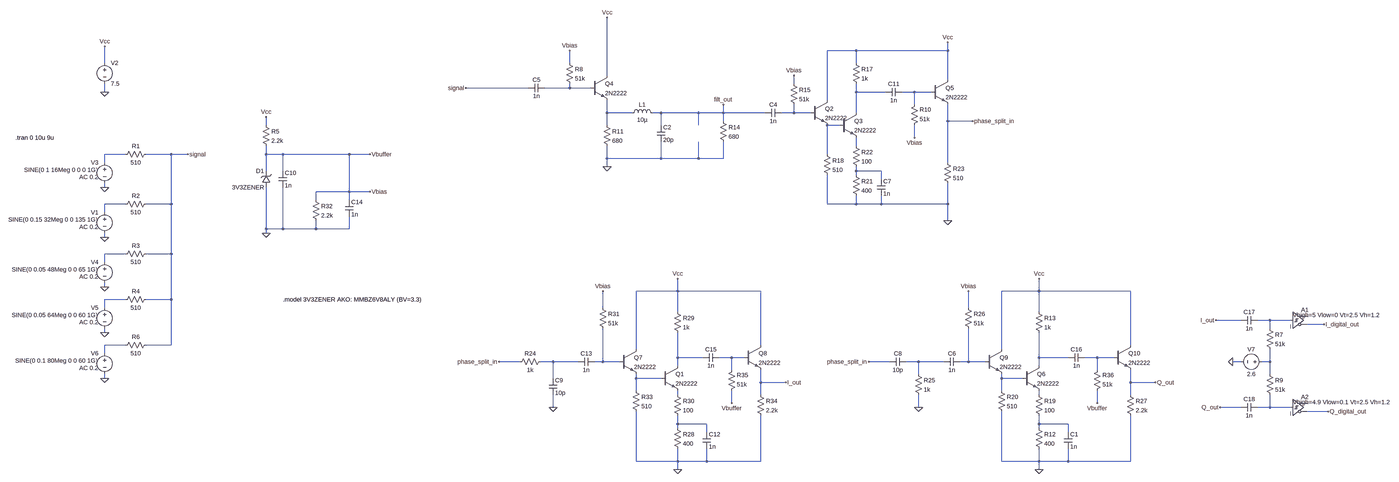
[diagram p0: schematic 16MHz_quadrature_phase_splitter.asc, whole sheet]
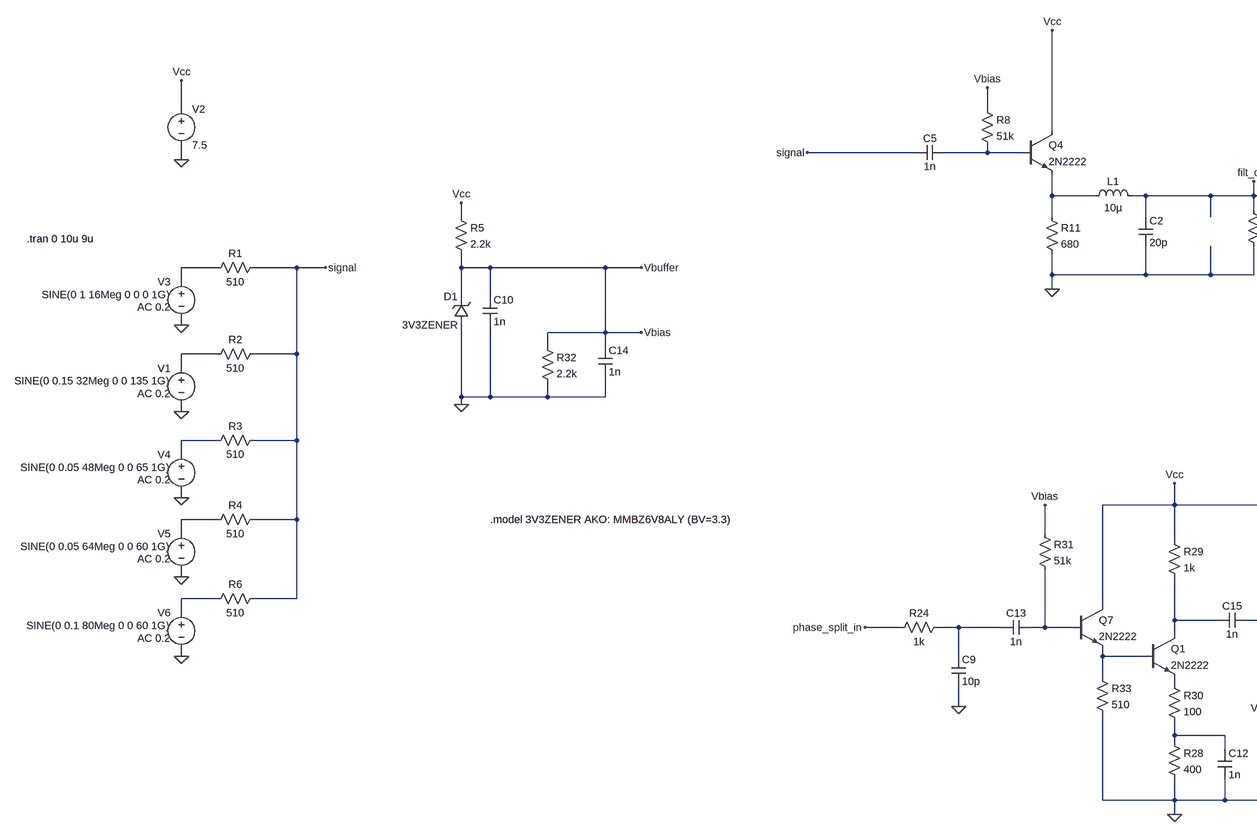
[diagram p1: schematic 16MHz_quadrature_phase_splitter.asc, part, row 1 of 1, column 1 of 2]
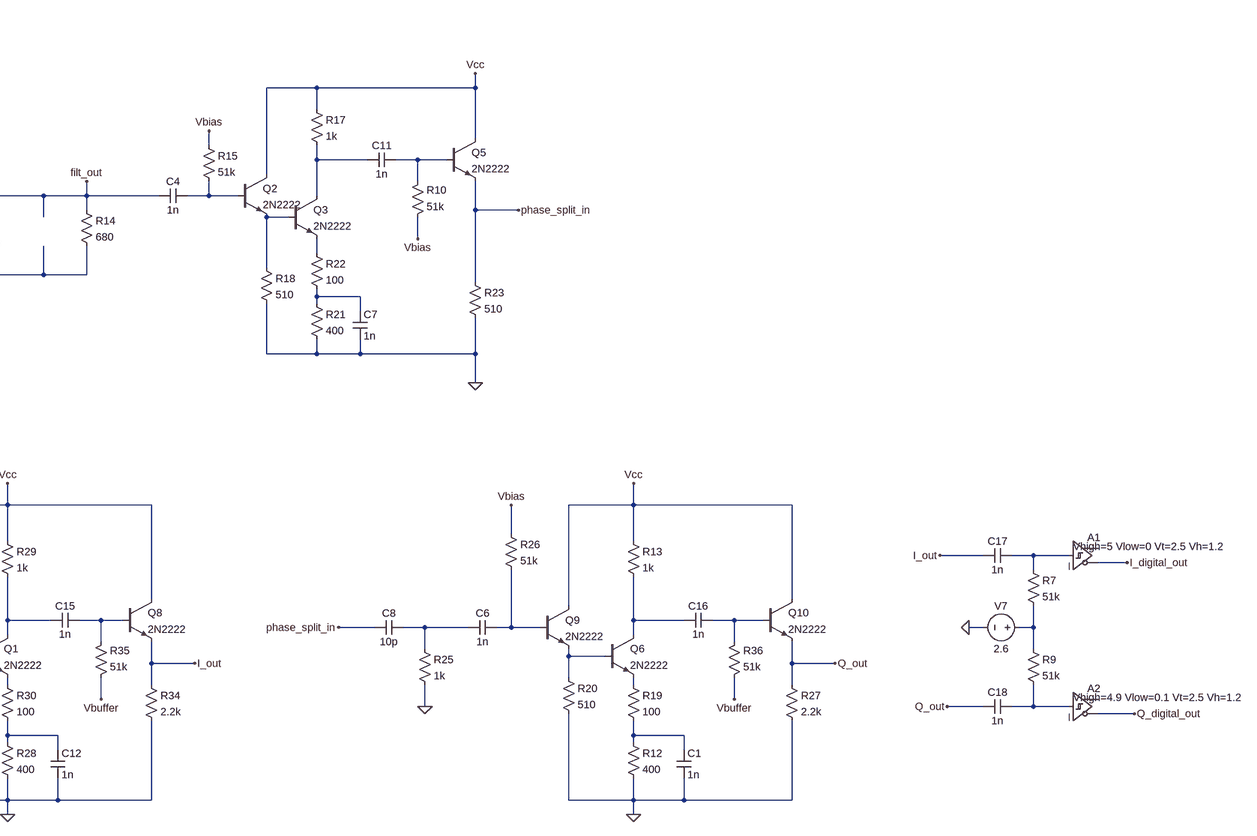
[diagram p2: schematic 16MHz_quadrature_phase_splitter.asc, part, row 1 of 1, column 2 of 2]
16MHz_quadrature_phase_splitter.asc, the LTspice schematic file:
Version 4
SHEET 1 4924 2628
WIRE 2736 32 2624 32
WIRE 3088 32 3088 0
WIRE 3088 32 2736 32
WIRE -464 80 -464 16
WIRE 1632 80 1632 32
WIRE 2736 80 2736 32
WIRE 1776 128 1776 -96
WIRE 3088 144 3088 32
WIRE 2496 160 2496 128
WIRE 1472 176 1232 176
WIRE 1632 176 1632 160
WIRE 1632 176 1536 176
WIRE 1712 176 1632 176
WIRE -464 192 -464 160
WIRE 2736 192 2736 160
WIRE 2848 192 2736 192
WIRE 2960 192 2912 192
WIRE 3024 192 2960 192
WIRE 2624 224 2624 32
WIRE 2960 240 2960 192
WIRE 1776 272 1776 224
WIRE 1872 272 1776 272
WIRE 1984 272 1952 272
WIRE 2128 272 1984 272
WIRE 2224 272 2224 240
WIRE 2224 272 2128 272
WIRE 2384 272 2224 272
WIRE 2496 272 2496 240
WIRE 2496 272 2448 272
WIRE 2560 272 2496 272
WIRE 2736 272 2736 192
WIRE 2224 304 2224 272
WIRE 3088 304 3088 240
WIRE 3184 304 3088 304
WIRE 288 320 288 288
WIRE 1776 320 1776 272
WIRE 1984 320 1984 272
WIRE 2128 320 2128 272
WIRE 2672 320 2624 320
WIRE 2960 368 2960 320
WIRE 2736 400 2736 368
WIRE -384 432 -464 432
WIRE -208 432 -304 432
WIRE -144 432 -208 432
WIRE 288 432 288 400
WIRE 352 432 288 432
WIRE 608 432 352 432
WIRE 688 432 608 432
WIRE 2624 432 2624 320
WIRE 1776 448 1776 400
WIRE 1984 448 1984 384
WIRE 1984 448 1776 448
WIRE 2128 448 2128 384
WIRE 2128 448 1984 448
WIRE 2224 448 2224 384
WIRE 2224 448 2128 448
WIRE -464 464 -464 432
WIRE 3088 464 3088 304
WIRE 1776 480 1776 448
WIRE 288 496 288 432
WIRE 352 496 352 432
WIRE 2736 496 2736 480
WIRE 2832 496 2736 496
WIRE 2736 512 2736 496
WIRE 2832 528 2832 496
WIRE -464 560 -464 544
WIRE 608 576 608 432
WIRE 608 576 480 576
WIRE 688 576 608 576
WIRE 480 608 480 576
WIRE 608 608 608 576
WIRE -384 624 -464 624
WIRE -208 624 -208 432
WIRE -208 624 -304 624
WIRE 2624 624 2624 512
WIRE 2736 624 2736 592
WIRE 2736 624 2624 624
WIRE 2832 624 2832 592
WIRE 2832 624 2736 624
WIRE 3088 624 3088 544
WIRE 3088 624 2832 624
WIRE -464 656 -464 624
WIRE 3088 688 3088 624
WIRE 288 720 288 560
WIRE 352 720 352 560
WIRE 352 720 288 720
WIRE 480 720 480 688
WIRE 480 720 352 720
WIRE 608 720 608 672
WIRE 608 720 480 720
WIRE 288 736 288 720
WIRE -464 752 -464 736
WIRE -384 816 -464 816
WIRE -208 816 -208 624
WIRE -208 816 -304 816
WIRE -464 848 -464 816
WIRE -464 944 -464 928
WIRE 2048 960 2048 912
WIRE 2048 960 1888 960
WIRE 2368 960 2048 960
WIRE 3440 960 3440 912
WIRE 3440 960 3296 960
WIRE 3792 960 3440 960
WIRE -384 992 -464 992
WIRE -208 992 -208 816
WIRE -208 992 -304 992
WIRE -464 1024 -464 992
WIRE 1760 1024 1760 960
WIRE 3168 1024 3168 960
WIRE 2048 1040 2048 960
WIRE 3440 1040 3440 960
WIRE 4304 1072 4208 1072
WIRE 4416 1072 4368 1072
WIRE 4496 1072 4416 1072
WIRE 4624 1088 4560 1088
WIRE 4416 1104 4416 1072
WIRE -464 1120 -464 1104
WIRE -384 1168 -464 1168
WIRE -208 1168 -208 992
WIRE -208 1168 -304 1168
WIRE 2368 1168 2368 960
WIRE 3792 1168 3792 960
WIRE 1888 1184 1888 960
WIRE 3296 1184 3296 960
WIRE -464 1200 -464 1168
WIRE 2048 1216 2048 1120
WIRE 2144 1216 2048 1216
WIRE 2256 1216 2208 1216
WIRE 2304 1216 2256 1216
WIRE 3440 1216 3440 1120
WIRE 3552 1216 3440 1216
WIRE 3664 1216 3616 1216
WIRE 3728 1216 3664 1216
WIRE 1440 1232 1360 1232
WIRE 1568 1232 1520 1232
WIRE 1664 1232 1568 1232
WIRE 1760 1232 1760 1104
WIRE 1760 1232 1728 1232
WIRE 1824 1232 1760 1232
WIRE 2864 1232 2784 1232
WIRE 2976 1232 2928 1232
WIRE 3072 1232 2976 1232
WIRE 3168 1232 3168 1104
WIRE 3168 1232 3136 1232
WIRE 3232 1232 3168 1232
WIRE 4304 1232 4272 1232
WIRE 4416 1232 4416 1184
WIRE 4416 1232 4384 1232
WIRE 2048 1248 2048 1216
WIRE 3440 1248 3440 1216
WIRE 2256 1264 2256 1216
WIRE 3664 1264 3664 1216
WIRE 2976 1280 2976 1232
WIRE 4416 1280 4416 1232
WIRE -464 1296 -464 1280
WIRE 1568 1296 1568 1232
WIRE 1888 1296 1888 1280
WIRE 1984 1296 1888 1296
WIRE 3296 1296 3296 1280
WIRE 3376 1296 3296 1296
WIRE 2368 1312 2368 1264
WIRE 2464 1312 2368 1312
WIRE 3792 1312 3792 1264
WIRE 3888 1312 3792 1312
WIRE 1888 1344 1888 1296
WIRE 3296 1344 3296 1296
WIRE 2048 1360 2048 1344
WIRE 2368 1360 2368 1312
WIRE 3440 1360 3440 1344
WIRE 3792 1360 3792 1312
WIRE 2256 1392 2256 1344
WIRE 3664 1392 3664 1344
WIRE 1568 1408 1568 1360
WIRE 2976 1408 2976 1360
WIRE 4304 1408 4224 1408
WIRE 4416 1408 4416 1360
WIRE 4416 1408 4368 1408
WIRE 4496 1408 4416 1408
WIRE 4640 1424 4560 1424
WIRE 2048 1472 2048 1440
WIRE 2160 1472 2048 1472
WIRE 3440 1472 3440 1440
WIRE 3552 1472 3440 1472
WIRE 2048 1488 2048 1472
WIRE 3440 1488 3440 1472
WIRE 2160 1504 2160 1472
WIRE 3552 1504 3552 1472
WIRE 1888 1616 1888 1424
WIRE 2048 1616 2048 1568
WIRE 2048 1616 1888 1616
WIRE 2160 1616 2160 1568
WIRE 2160 1616 2048 1616
WIRE 2368 1616 2368 1440
WIRE 2368 1616 2160 1616
WIRE 3296 1616 3296 1424
WIRE 3440 1616 3440 1568
WIRE 3440 1616 3296 1616
WIRE 3552 1616 3552 1568
WIRE 3552 1616 3440 1616
WIRE 3792 1616 3792 1440
WIRE 3792 1616 3552 1616
WIRE 2048 1648 2048 1616
WIRE 3440 1648 3440 1616
FLAG -464 192 0
FLAG -464 16 Vcc
FLAG -464 560 0
FLAG 1776 -96 Vcc
FLAG -144 432 signal
FLAG 1232 176 signal
FLAG -464 752 0
FLAG -464 944 0
FLAG -464 1120 0
FLAG 3088 0 Vcc
FLAG 2224 240 filt_out
FLAG -464 1296 0
FLAG 2048 1648 0
FLAG 2048 912 Vcc
FLAG 2464 1312 I_out
FLAG 3184 304 phase_split_in
FLAG 3440 1648 0
FLAG 3440 912 Vcc
FLAG 3888 1312 Q_out
FLAG 3088 688 0
FLAG 1632 32 Vbias
FLAG 2496 128 Vbias
FLAG 1760 960 Vbias
FLAG 3168 960 Vbias
FLAG 1360 1232 phase_split_in
FLAG 1568 1408 0
FLAG 2976 1408 0
FLAG 2784 1232 phase_split_in
FLAG 288 288 Vcc
FLAG 288 736 0
FLAG 688 576 Vbias
FLAG 3664 1392 Vbuffer
FLAG 2960 368 Vbias
FLAG 2256 1392 Vbuffer
FLAG 688 432 Vbuffer
FLAG 1776 480 0
FLAG 4208 1072 I_out
FLAG 4624 1088 I_digital_out
FLAG 4224 1408 Q_out
FLAG 4640 1424 Q_digital_out
FLAG 4272 1232 0
SYMBOL voltage -464 64 R0
WINDOW 123 0 0 Left 0
WINDOW 39 0 0 Left 0
SYMATTR InstName V2
SYMATTR Value 7.5
SYMBOL voltage -464 448 M0
WINDOW 3 24 44 Left 2
WINDOW 123 24 72 Left 2
WINDOW 39 0 0 Left 0
SYMATTR Value SINE(0 1 16Meg 0 0 0 1G)
SYMATTR Value2 AC 0.2
SYMATTR InstName V3
SYMBOL npn 1712 128 R0
SYMATTR InstName Q4
SYMATTR Value 2N2222
SYMBOL cap 1536 160 R90
WINDOW 0 0 32 VBottom 2
WINDOW 3 32 32 VTop 2
SYMATTR InstName C5
SYMATTR Value 1n
SYMBOL res 1616 64 R0
SYMATTR InstName R8
SYMATTR Value 51k
SYMBOL res 1760 304 R0
SYMATTR InstName R11
SYMATTR Value 680
SYMBOL res -288 416 R90
WINDOW 0 0 56 VBottom 2
WINDOW 3 32 56 VTop 2
SYMATTR InstName R1
SYMATTR Value 510
SYMBOL voltage -464 640 M0
WINDOW 3 24 44 Left 2
WINDOW 123 24 72 Left 2
WINDOW 39 0 0 Left 0
SYMATTR Value SINE(0 0.15 32Meg 0 0 135 1G)
SYMATTR Value2 AC 0.2
SYMATTR InstName V1
SYMBOL res -288 608 R90
WINDOW 0 0 56 VBottom 2
WINDOW 3 32 56 VTop 2
SYMATTR InstName R2
SYMATTR Value 510
SYMBOL voltage -464 832 M0
WINDOW 3 24 44 Left 2
WINDOW 123 24 72 Left 2
WINDOW 39 0 0 Left 0
SYMATTR Value SINE(0 0.05 48Meg 0 0 65 1G)
SYMATTR Value2 AC 0.2
SYMATTR InstName V4
SYMBOL res -288 800 R90
WINDOW 0 0 56 VBottom 2
WINDOW 3 32 56 VTop 2
SYMATTR InstName R3
SYMATTR Value 510
SYMBOL voltage -464 1008 M0
WINDOW 3 24 44 Left 2
WINDOW 123 24 72 Left 2
WINDOW 39 0 0 Left 0
SYMATTR Value SINE(0 0.05 64Meg 0 0 60 1G)
SYMATTR Value2 AC 0.2
SYMATTR InstName V5
SYMBOL res -288 976 R90
WINDOW 0 0 56 VBottom 2
WINDOW 3 32 56 VTop 2
SYMATTR InstName R4
SYMATTR Value 510
SYMBOL ind 1856 288 R270
WINDOW 0 32 56 VTop 2
WINDOW 3 5 56 VBottom 2
SYMATTR InstName L1
SYMATTR Value 10µ
SYMBOL cap 1968 320 R0
SYMATTR InstName C2
SYMATTR Value 20p
SYMBOL res 2208 288 R0
SYMATTR InstName R14
SYMATTR Value 680
SYMBOL cap 2448 256 R90
WINDOW 0 0 32 VBottom 2
WINDOW 3 32 32 VTop 2
SYMATTR InstName C4
SYMATTR Value 1n
SYMBOL npn 2560 224 R0
SYMATTR InstName Q2
SYMATTR Value 2N2222
SYMBOL res 2480 144 R0
SYMATTR InstName R15
SYMATTR Value 51k
SYMBOL res 2608 416 R0
SYMATTR InstName R18
SYMATTR Value 510
SYMBOL npn 2672 272 R0
SYMATTR InstName Q3
SYMATTR Value 2N2222
SYMBOL res 2720 384 R0
SYMATTR InstName R22
SYMATTR Value 100
SYMBOL res 2720 64 R0
SYMATTR InstName R17
SYMATTR Value 1k
SYMBOL res 2720 496 R0
SYMATTR InstName R21
SYMATTR Value 400
SYMBOL cap 2816 528 R0
SYMATTR InstName C7
SYMATTR Value 1n
SYMBOL npn 3024 144 R0
SYMATTR InstName Q5
SYMATTR Value 2N2222
SYMBOL res 3072 448 R0
SYMATTR InstName R23
SYMATTR Value 510
SYMBOL res 1536 1216 R90
WINDOW 0 0 56 VBottom 2
WINDOW 3 32 56 VTop 2
SYMATTR InstName R24
SYMATTR Value 1k
SYMBOL cap 2928 1216 R90
WINDOW 0 0 32 VBottom 2
WINDOW 3 32 32 VTop 2
SYMATTR InstName C8
SYMATTR Value 10p
SYMBOL cap 1552 1296 R0
SYMATTR InstName C9
SYMATTR Value 10p
SYMBOL res 2960 1264 R0
SYMATTR InstName R25
SYMATTR Value 1k
SYMBOL voltage -464 1184 M0
WINDOW 3 24 44 Left 2
WINDOW 123 24 72 Left 2
WINDOW 39 0 0 Left 0
SYMATTR Value SINE(0 0.1 80Meg 0 0 60 1G)
SYMATTR Value2 AC 0.2
SYMATTR InstName V6
SYMBOL res -288 1152 R90
WINDOW 0 0 56 VBottom 2
WINDOW 3 32 56 VTop 2
SYMATTR InstName R6
SYMATTR Value 510
SYMBOL npn 1984 1248 R0
SYMATTR InstName Q1
SYMATTR Value 2N2222
SYMBOL res 2032 1472 R0
SYMATTR InstName R28
SYMATTR Value 400
SYMBOL res 2032 1024 R0
SYMATTR InstName R29
SYMATTR Value 1k
SYMBOL res 2032 1344 R0
SYMATTR InstName R30
SYMATTR Value 100
SYMBOL cap 2144 1504 R0
SYMATTR InstName C12
SYMATTR Value 1n
SYMBOL npn 1824 1184 R0
SYMATTR InstName Q7
SYMATTR Value 2N2222
SYMBOL res 1872 1328 R0
SYMATTR InstName R33
SYMATTR Value 510
SYMBOL res 1744 1008 R0
SYMATTR InstName R31
SYMATTR Value 51k
SYMBOL cap 1728 1216 R90
WINDOW 0 0 32 VBottom 2
WINDOW 3 32 32 VTop 2
SYMATTR InstName C13
SYMATTR Value 1n
SYMBOL npn 2304 1168 R0
SYMATTR InstName Q8
SYMATTR Value 2N2222
SYMBOL res 2352 1344 R0
SYMATTR InstName R34
SYMATTR Value 2.2k
SYMBOL npn 3376 1248 R0
SYMATTR InstName Q6
SYMATTR Value 2N2222
SYMBOL res 3424 1472 R0
SYMATTR InstName R12
SYMATTR Value 400
SYMBOL res 3424 1024 R0
SYMATTR InstName R13
SYMATTR Value 1k
SYMBOL res 3424 1344 R0
SYMATTR InstName R19
SYMATTR Value 100
SYMBOL cap 3536 1504 R0
SYMATTR InstName C1
SYMATTR Value 1n
SYMBOL npn 3232 1184 R0
SYMATTR InstName Q9
SYMATTR Value 2N2222
SYMBOL res 3280 1328 R0
SYMATTR InstName R20
SYMATTR Value 510
SYMBOL res 3152 1008 R0
SYMATTR InstName R26
SYMATTR Value 51k
SYMBOL cap 3136 1216 R90
WINDOW 0 0 32 VBottom 2
WINDOW 3 32 32 VTop 2
SYMATTR InstName C6
SYMATTR Value 1n
SYMBOL npn 3728 1168 R0
SYMATTR InstName Q10
SYMATTR Value 2N2222
SYMBOL res 3776 1344 R0
SYMATTR InstName R27
SYMATTR Value 2.2k
SYMBOL zener 304 560 R180
WINDOW 0 24 64 Left 2
WINDOW 3 24 0 Left 2
SYMATTR InstName D1
SYMATTR Value 3V3ZENER
SYMATTR Description Diode
SYMATTR Type diode
SYMBOL res 272 304 R0
SYMATTR InstName R5
SYMATTR Value 2.2k
SYMBOL res 464 592 R0
SYMATTR InstName R32
SYMATTR Value 2.2k
SYMBOL cap 336 496 R0
SYMATTR InstName C10
SYMATTR Value 1n
SYMBOL cap 592 608 R0
SYMATTR InstName C14
SYMATTR Value 1n
SYMBOL cap 2912 176 R90
WINDOW 0 0 32 VBottom 2
WINDOW 3 32 32 VTop 2
SYMATTR InstName C11
SYMATTR Value 1n
SYMBOL res 2944 336 M180
WINDOW 0 36 76 Left 2
WINDOW 3 36 40 Left 2
SYMATTR InstName R10
SYMATTR Value 51k
SYMBOL cap 2208 1200 R90
WINDOW 0 0 32 VBottom 2
WINDOW 3 32 32 VTop 2
SYMATTR InstName C15
SYMATTR Value 1n
SYMBOL res 2240 1360 M180
WINDOW 0 36 76 Left 2
WINDOW 3 36 40 Left 2
SYMATTR InstName R35
SYMATTR Value 51k
SYMBOL cap 3616 1200 R90
WINDOW 0 0 32 VBottom 2
WINDOW 3 32 32 VTop 2
SYMATTR InstName C16
SYMATTR Value 1n
SYMBOL res 3648 1360 M180
WINDOW 0 36 76 Left 2
WINDOW 3 36 40 Left 2
SYMATTR InstName R36
SYMATTR Value 51k
SYMBOL Digital\\schmitt 4496 1008 R0
WINDOW 3 8 44 Left 2
SYMATTR Value Vhigh=5 Vlow=0 Vt=2.5 Vh=1.2
SYMATTR InstName A1
SYMBOL cap 4368 1056 R90
WINDOW 0 0 32 VBottom 2
WINDOW 3 32 32 VTop 2
SYMATTR InstName C17
SYMATTR Value 1n
SYMBOL voltage 4400 1232 R90
WINDOW 0 -32 56 VBottom 2
WINDOW 3 32 56 VTop 2
WINDOW 123 0 0 Left 0
WINDOW 39 0 0 Left 0
SYMATTR InstName V7
SYMATTR Value 2.6
SYMBOL res 4400 1088 R0
SYMATTR InstName R7
SYMATTR Value 51k
SYMBOL res 4400 1264 R0
SYMATTR InstName R9
SYMATTR Value 51k
SYMBOL cap 4368 1392 R90
WINDOW 0 0 32 VBottom 2
WINDOW 3 32 32 VTop 2
SYMATTR InstName C18
SYMATTR Value 1n
SYMBOL Digital\\schmitt 4496 1344 R0
WINDOW 3 8 44 Left 2
SYMATTR Value Vhigh=4.9 Vlow=0.1 Vt=2.5 Vh=1.2
SYMATTR InstName A2
TEXT -808 368 Left 2 !.tran 0 10u 9u
TEXT 352 992 Left 2 !.model 3V3ZENER AKO: MMBZ6V8ALY (BV=3.3)

The netlist it stands for:
* 16MHz_quadrature_phase_splitter.asc
V2 Vcc 0 7.5
V3 N008 0 SINE(0 1 16Meg 0 0 0 1G) AC 0.2
Q4 Vcc N001 N004 0 2N2222
C5 N001 signal 1n
R8 Vbuffer N001 51k
R11 N004 0 680
R1 signal N008 510
V1 N010 0 SINE(0 0.15 32Meg 0 0 135 1G) AC 0.2
R2 signal N010 510
V4 N011 0 SINE(0 0.05 48Meg 0 0 65 1G) AC 0.2
R3 signal N011 510
V5 N012 0 SINE(0 0.05 64Meg 0 0 60 1G) AC 0.2
R4 signal N012 510
L1 N004 filt_out 10µ
C2 filt_out 0 20p
R14 filt_out 0 680
C4 N005 filt_out 1n
Q2 Vcc N005 N006 0 2N2222
R15 Vbuffer N005 51k
R18 N006 0 510
Q3 N002 N006 N007 0 2N2222
R22 N007 N009 100
R17 Vcc N002 1k
R21 N009 0 400
C7 N009 0 1n
Q5 Vcc N003 phase_split_in 0 2N2222
R23 phase_split_in 0 510
R24 N019 phase_split_in 1k
C8 N021 phase_split_in 10p
C9 N019 0 10p
R25 N021 0 1k
V6 N014 0 SINE(0 0.1 80Meg 0 0 60 1G) AC 0.2
R6 signal N014 510
Q1 N015 N024 N026 0 2N2222
R28 N029 0 400
R29 Vcc N015 1k
R30 N026 N029 100
C12 N029 0 1n
Q7 Vcc N020 N024 0 2N2222
R33 N024 0 510
R31 Vbuffer N020 51k
C13 N020 N019 1n
Q8 Vcc N016 I_out 0 2N2222
R34 I_out 0 2.2k
Q6 N017 N025 N027 0 2N2222
R12 N030 0 400
R13 Vcc N017 1k
R19 N027 N030 100
C1 N030 0 1n
Q9 Vcc N022 N025 0 2N2222
R20 N025 0 510
R26 Vbuffer N022 51k
C6 N022 N021 1n
Q10 Vcc N018 Q_out 0 2N2222
R27 Q_out 0 2.2k
D1 0 Vbuffer 3V3ZENER
R5 Vcc Vbuffer 2.2k
R32 Vbuffer 0 2.2k
C10 Vbuffer 0 1n
C14 Vbuffer 0 1n
C11 N003 N002 1n
R10 Vbuffer N003 51k
C15 N016 N015 1n
R35 Vbuffer N016 51k
C16 N018 N017 1n
R36 Vbuffer N018 51k
A1 N013 0 0 0 0 I_digital_out 0 0 SCHMITT Vhigh=5 Vlow=0 Vt=2.5 Vh=1.2
C17 N013 I_out 1n
V7 N023 0 2.6
R7 N013 N023 51k
R9 N023 N028 51k
C18 N028 Q_out 1n
A2 N028 0 0 0 0 Q_digital_out 0 0 SCHMITT Vhigh=4.9 Vlow=0.1 Vt=2.5 Vh=1.2
.model D D
.lib standard.dio
.model NPN NPN
.model PNP PNP
.lib standard.bjt
.tran 0 10u 9u
.model 3V3ZENER AKO: MMBZ6V8ALY (BV=3.3)
.backanno
.end